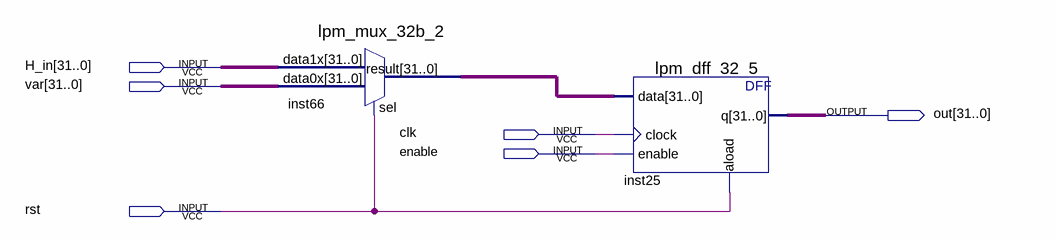
[diagram p0: schematic sheet]
// Quartus schematic save_var.bdf as structural Verilog: 2 symbols, 6 pins
module save_var (
  input  [31:0] H_in,
  input  [31:0] \var ,
  input  clk,
  input  enable,
  input  rst,
  output [31:0] out
);

  wire [31:0] inst66_result;

  lpm_mux_32b_2 inst66 (.data1x(H_in), .data0x(\var ), .sel(rst), .result(inst66_result));
  lpm_dff_32_5 inst25 (.data(inst66_result), .clock(clk), .enable(enable), .aload(rst), .q(out));
endmodule
